# Altium project Danger_Zona_2016_Actuators.PrjPcb
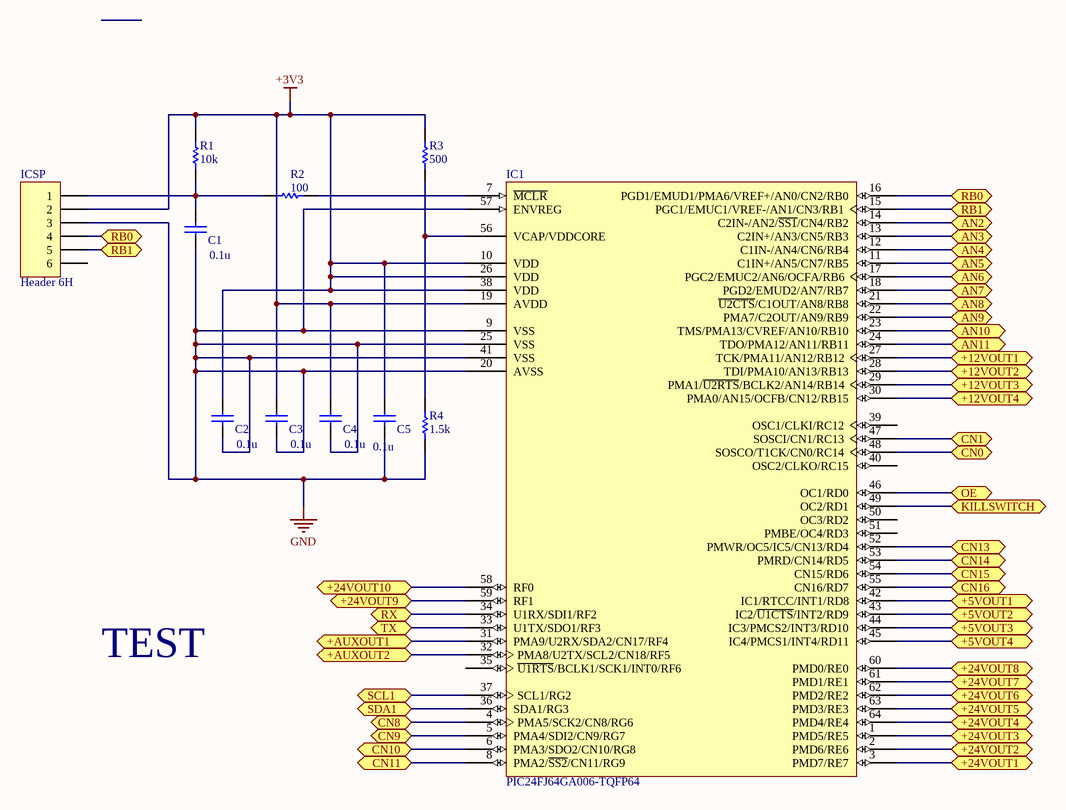
[diagram p0: Sheet1.SchDoc]
2 sheets, 11 parts. Net scope: flat (ports and power ports of the same name join across sheets).
Sheets:
  Sheet1.SchDoc
  Sheet2.SchDoc

## Sheet Sheet1.SchDoc
size A4

### Parts
C1  CAP  [1803374]  (value not drawn)
C2  CAP  [1803374]  (value not drawn)
C3  CAP  [1803374]  (value not drawn)
C4  CAP  [1803374]  (value not drawn)
C5  CAP  [1803374]  (value not drawn)
IC1  PIC24FJ64GA006-TQFP64  [1803374]
ICSP  Header 6H  [HDR1X6H]
R1  RES  [1803374]  (value not drawn)
R2  RES  [1803374]  (value not drawn)
R3  RES  [1803374]  (value not drawn)
R4  RES  [1803374]  (value not drawn)

### Ports
+5VOUT1, +5VOUT2, +5VOUT3, +5VOUT4, +12VOUT1, +12VOUT2, +12VOUT3, +12VOUT4, +24VOUT1, +24VOUT2, +24VOUT3, +24VOUT4, +24VOUT5, +24VOUT6, +24VOUT7, +24VOUT8, +24VOUT9, +24VOUT10, +AUXOUT1, +AUXOUT2, AN2, AN3, AN4, AN5, AN6, AN7, AN8, AN9, AN10, AN11, CN0, CN1, CN8, CN9, CN10, CN11, CN13, CN14, CN15, CN16, KILLSWITCH, OE, RB0, RB1, RX, SCL1, SDA1, TX

### Nets
+3V3: C2.2 C3.2 C4.2 C5.2 IC1.10(VDD) IC1.19(AVDD) IC1.26(VDD) IC1.38(VDD) ICSP.2 R1.2 R3.2
GND: C1.1 C2.1 C3.1 C4.1 C5.1 IC1.9(VSS) IC1.20(AVSS) IC1.25(VSS) IC1.41(VSS) IC1.57(ENVREG) ICSP.3 R4.1
NetC1_2: C1.2 ICSP.1 R1.1 R2.1
NetIC1_1: IC1.1(PMD5/RE5) ; port +24VOUT3
NetIC1_2: IC1.2(PMD6/RE6) ; port +24VOUT2
NetIC1_3: IC1.3(PMD7/RE7) ; port +24VOUT1
NetIC1_4: IC1.4(PMA5/SCK2/CN8/RG6) ; port CN8
NetIC1_5: IC1.5(PMA4/SDI2/CN9/RG7) ; port CN9
NetIC1_6: IC1.6(PMA3/SDO2/CN10/RG8) ; port CN10
NetIC1_7: IC1.7(~{MCLR}) R2.2
NetIC1_8: IC1.8(PMA2/~{SS2}/CN11/RG9) ; port CN11
NetIC1_11: IC1.11(C1IN+/AN5/CN7/RB5) ; port AN5
NetIC1_12: IC1.12(C1IN-/AN4/CN6/RB4) ; port AN4
NetIC1_13: IC1.13(C2IN+/AN3/CN5/RB3) ; port AN3
NetIC1_14: IC1.14(C2IN-/AN2/~{SS1}/CN4/RB2) ; port AN2
NetIC1_15: IC1.15(PGC1/EMUC1/VREF-/AN1/CN3/RB1) ICSP.5 ; port RB1
NetIC1_16: IC1.16(PGD1/EMUD1/PMA6/VREF+/AN0/CN2/RB0) ICSP.4 ; port RB0
NetIC1_17: IC1.17(PGC2/EMUC2/AN6/OCFA/RB6) ; port AN6
NetIC1_18: IC1.18(PGD2/EMUD2/AN7/RB7) ; port AN7
NetIC1_21: IC1.21(~{U2CTS}/C1OUT/AN8/RB8) ; port AN8
NetIC1_22: IC1.22(PMA7/C2OUT/AN9/RB9) ; port AN9
NetIC1_23: IC1.23(TMS/PMA13/CVREF/AN10/RB10) ; port AN10
NetIC1_24: IC1.24(TDO/PMA12/AN11/RB11) ; port AN11
NetIC1_27: IC1.27(TCK/PMA11/AN12/RB12) ; port +12VOUT1
NetIC1_28: IC1.28(TDI/PMA10/AN13/RB13) ; port +12VOUT2
NetIC1_29: IC1.29(PMA1/~{U2RTS}/BCLK2/AN14/RB14) ; port +12VOUT3
NetIC1_30: IC1.30(PMA0/AN15/OCFB/CN12/RB15) ; port +12VOUT4
NetIC1_31: IC1.31(PMA9/U2RX/SDA2/CN17/RF4) ; port +AUXOUT1
NetIC1_32: IC1.32(PMA8/U2TX/SCL2/CN18/RF5) ; port +AUXOUT2
NetIC1_33: IC1.33(U1TX/SDO1/RF3) ; port TX
NetIC1_34: IC1.34(U1RX/SDI1/RF2) ; port RX
NetIC1_36: IC1.36(SDA1/RG3) ; port SDA1
NetIC1_37: IC1.37(SCL1/RG2) ; port SCL1
NetIC1_42: IC1.42(IC1/RTCC/INT1/RD8) ; port +5VOUT1
NetIC1_43: IC1.43(IC2/~{U1CTS}/INT2/RD9) ; port +5VOUT2
NetIC1_44: IC1.44(IC3/PMCS2/INT3/RD10) ; port +5VOUT3
NetIC1_45: IC1.45(IC4/PMCS1/INT4/RD11) ; port +5VOUT4
NetIC1_46: IC1.46(OC1/RD0) ; port OE
NetIC1_47: IC1.47(SOSCI/CN1/RC13) ; port CN1
NetIC1_48: IC1.48(SOSCO/T1CK/CN0/RC14) ; port CN0
NetIC1_49: IC1.49(OC2/RD1) ; port KILLSWITCH
NetIC1_52: IC1.52(PMWR/OC5/IC5/CN13/RD4) ; port CN13
NetIC1_53: IC1.53(PMRD/CN14/RD5) ; port CN14
NetIC1_54: IC1.54(CN15/RD6) ; port CN15
NetIC1_55: IC1.55(CN16/RD7) ; port CN16
NetIC1_56: IC1.56(VCAP/VDDCORE) R3.1 R4.2
NetIC1_58: IC1.58(RF0) ; port +24VOUT10
NetIC1_59: IC1.59(RF1) ; port +24VOUT9
NetIC1_60: IC1.60(PMD0/RE0) ; port +24VOUT8
NetIC1_61: IC1.61(PMD1/RE1) ; port +24VOUT7
NetIC1_62: IC1.62(PMD2/RE2) ; port +24VOUT6
NetIC1_63: IC1.63(PMD3/RE3) ; port +24VOUT5
NetIC1_64: IC1.64(PMD4/RE4) ; port +24VOUT4

Not connected (* = marked no-connect by the designer): IC1 35(~{U1RTS}/BCLK1/SCK1/INT0/RF6) 39(OSC1/CLKI/RC12) 40(OSC2/CLKO/RC15) 50(OC3/RD2) 51(PMBE/OC4/RD3); ICSP 6

### Notes on the sheet
- TEST
- (in symbol CMP-1013-00050-1) 100; 10k; 500; 1.5k
- (in symbol CMP-1036-00215-1) 0.1u

### Library data of the parts
C1-C5 = CMP-1036-00215-1
IC1 = CMP-0046-00167-2
ICSP = Header 6H: Header, 6-Pin, Right Angle; LatestRevisionDate: 17-Jul-2002; LatestRevisionNote: Re-released for DXP Platform.; Publisher: Altium Limited
R1-R4 = CMP-1013-00050-1

## Sheet Sheet2.SchDoc
size A